# Altium schematic sheet dcdc_60v_12v.SchDoc
size A4; SheetNumber: 8; SheetTotal: 8; SPICEModelCacheOFSRASBJ: <root> / <DocumentId>OFSRASBJ</DocumentId> / <CacheFrame Number="0"> / <Model Name="tmk325b7226_m-pr" Kind="CKT"> / <Text>* TMK325B7226_M-PR     SPICE MODEL  ( General Type ) / *-------------------------------------------------------------------------------------------------------- / * Model Generated by TAIYO YUDEN Corporation (http://www.ty-top.com) / * Version 1.0 / * TAIYO YUDEN Control No. 170508_150330 / * Copyright(c) 2015 TAIYO YUDEN CO.,LTD. All Rights Reserved. / *-------------------------------------------------------------------------------------------------------- / * / * Products Name : Multilayer Ceramic Capacitors / * / * Characteristics : / *     Capacitance : 22 uF , Rated Voltage : 25V , TCC : X7R / *     Case Size : 3.2 x 2.5 / 0.126 x 0.098 [mm/inch] , Thickness : 2.5 / 0.098 [mm/inch] / *     (Conditions: Temperature = 25 degC , DC Bias Current/Voltage = 0A / 0V) / * / * Frequency Range : 40Hz - 3GHz / * / * External Node Assignments : / * / *  1  o---| |---o  2 / * / *-------------------------------------------------------------------------------------------------------- / .SubCkt TMK325B7226_M-PR 1 2 / **************************** / C0 1 110 20.232u / Cm 1 101 1.4192u / C1 101 102 0.46072u / Rc1 101 102 383.24 / C2 102 103 0.25707u / Rc2 102 103 27.255 / C3 103 110 0.063707u / Rc3 103 110 9.0927 / C2m 1 301 2.8514u / C21 301 302 4.5381u / Rc21 301 302 971.82 / C22 302 303 5.7922u / Rc22 302 303 294.55 / C23 303 304 5.617u / Rc23 303 304 301.8 / C24 304 305 2.3653u / Rc24 304 305 34.154 / C25 305 306 1.0031u / Rc25 305 306 28.966 / C26 306 307 0.1463u / Rc26 306 307 1.8028 / C27 307 308 0.26562u / Rc27 307 308 0.93359 / C28 308 309 0.29812u / Rc28 308 309 0.7461 / C29 309 110 3869.2p / Rc29 309 110 3.935 / Rp0 1 110 4.54545454545455Meg / L0 110 120 0.19079n / Lm 120 130 0.18902n / L1 120 121 0.21321n / RL1 121 130 0.13225 / L2 120 122 0.31017n / RL2 122 130 0.16258 / L3 120 123 1.2596n / RL3 123 130 144.01 / CR 120 124 3.8286u / LR 124 125 0.37731n / RR 125 130 10.878m / CL 130 140 3.0471p / LL 130 140 0.15642n / RL 130 140 11.971 / Rs 140 2 2.3557m / **************************** / .ends TMK325B7226_M-PR</Text> / </Model> / </CacheFrame> / </root>
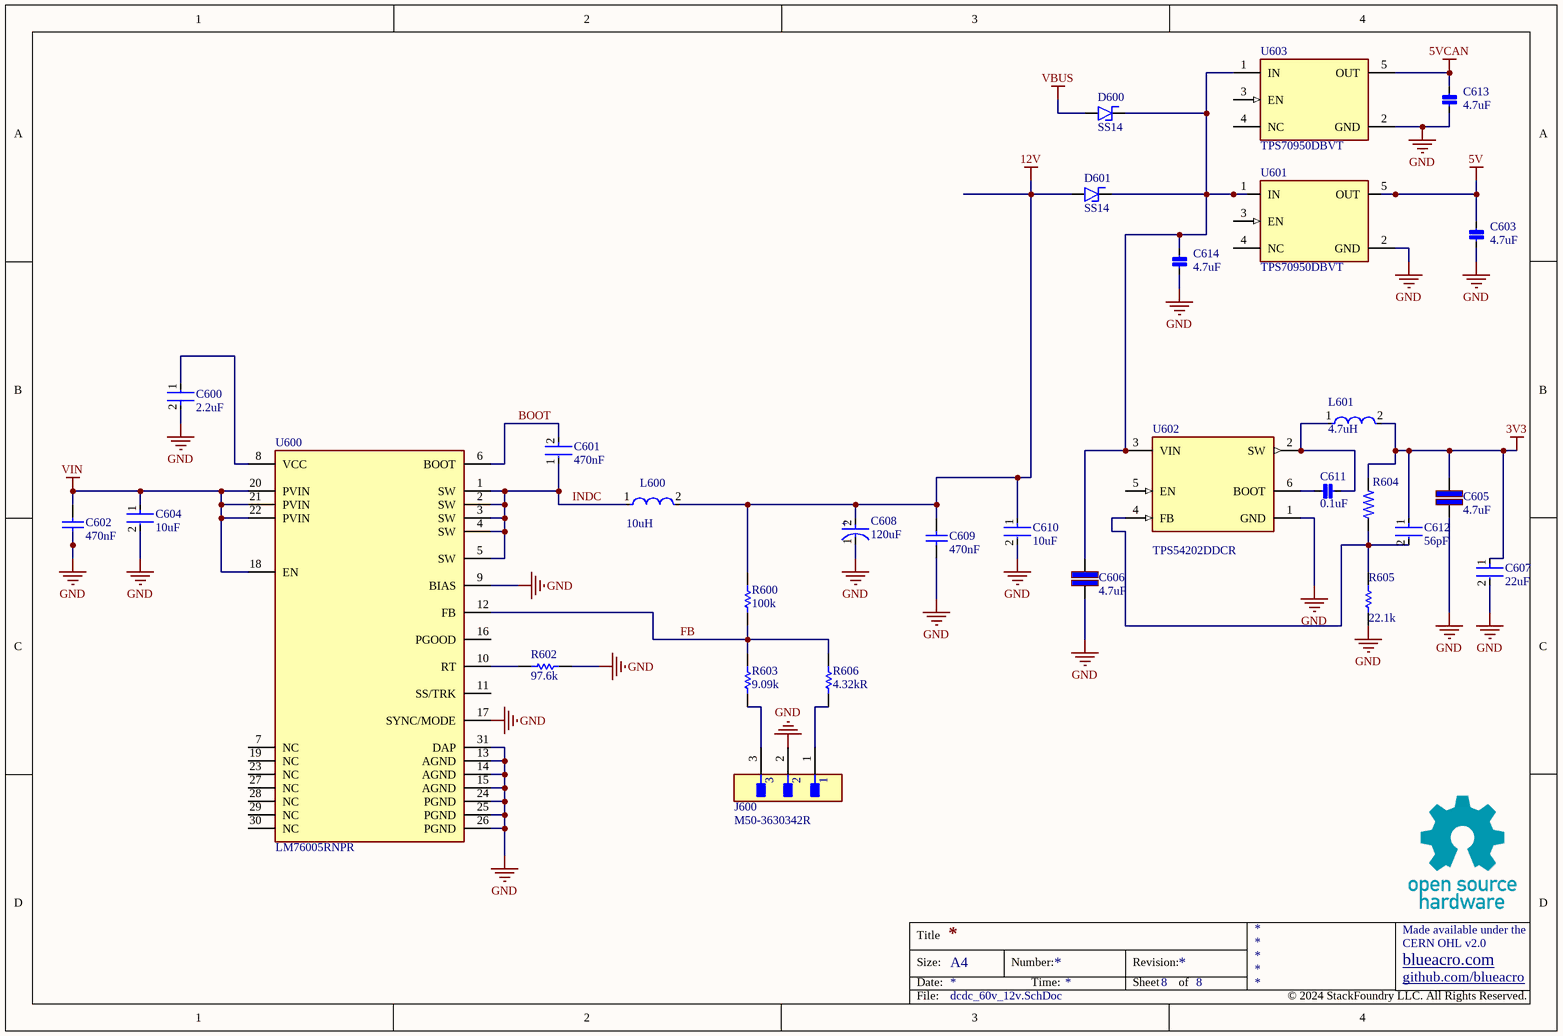
[diagram p0: dcdc_60v_12v.SchDoc]

## Parts
C600  value 2.2uF  [FP-C1608-080-0_1-IPC_A]  (hidden comment: CAP 2.2uF 0603 16V X6S)
C601  value 470nF  [FP-C1608-080-0_1-IPC_A]  (hidden comment: CAP 0.47uF 50V 0603)
C602  value 470nF  [CAPC1210(3225)230_M]  (hidden comment: CAP 0.47uF 1210 50V X7R)
C603  value 4.7uF  [FP-CL10-IPC_C]  (hidden comment: CAP 4.7uF 0603 6.3V X7R)
C604  value 10uF  [FP-GRM32E-0_2-0_3-MFG]  (hidden comment: CAP 10uF 1210 63V X7R)
C605  value 4.7uF  [CAPC3225X20N]  (hidden comment: CAP 4.7uF 50V X7R 1210)
C606  value 4.7uF  [CAPC3225X20N]  (hidden comment: CAP 4.7uF 50V X7R 1210)
C607  value 22uF  [FP-1210-L_3_2_0_3-W_2_5_0-MFG]  (hidden comment: CAP 22uF 25V 1210 X7R)
C608  value 120uF  [FP-OS-CON-SMT-F12-MFG]  (hidden comment: CAP 120uF 35V Poly 10mm)
C609  value 470nF  [CAPC1210(3225)230_M]  (hidden comment: CAP 0.47uF 1210 50V X7R)
C610  value 10uF  [FP-GRM32E-0_2-0_3-MFG]  (hidden comment: CAP 10uF 1210 63V X7R)
C611  value 0.1uF  [FP-CL10-IPC_B]  (hidden comment: CAP 0.1uF 50V X7R 0603)
C612  value 56pF  [FP-C0603C-CF-IPC_B]  (hidden comment: C0603C560J5GACTU)
C613  value 4.7uF  [FP-CL10-IPC_C]  (hidden comment: CAP 4.7uF 0603 6.3V X7R)
C614  value 4.7uF  [FP-CL10-IPC_C]  (hidden comment: CAP 4.7uF 0603 6.3V X7R)
D600  SS14  [SMA]
D601  SS14  [SMA]
J600  M50-3630342R  [FP-M50-3630342R-MFG]
L600  value 10uH  [FP-IHLP-5050FD-FP_2_945x4-MFG]  (hidden comment: IHLP5050FDER100M01)
L601  value 4.7uH  [FP-SRN4018-MFG]  (hidden comment: SRN4018-4R7M)
R600  value 100k  [RESC1608-IPC-LL]  (hidden comment: 100k 0603 1%)
R602  value 97.6k  [RESC1608-IPC-LL]  (hidden comment: 97.6k 0603 1%)
R603  value 9.09k  [RESC1608-IPC-LL]  (hidden comment: 9.09k 0603 1%)
R604  100k 0603 1%  [RESC1608-IPC-LL]  (value not drawn)
R605  value 22.1k  [RESC1608-IPC-LL]  (hidden comment: 22.1k 0603 0.1%)
R606  value 4.32kR  [RESC1608X55X30LL15T15]  (hidden comment: 4.32k 0603 1%)
U600  LM76005RNPR  [FP-RNP0030A-MFG]
U601  TPS70950DBVT  [FP-DBV0005A-IPC_B]
U602  TPS54202DDCR  [FP-DDC0006A-IPC_C]
U603  TPS70950DBVT  [FP-DBV0005A-IPC_B]

## Nets
3V3: C605.2 C607.1 C612.1 L601.2 R604.2
5V: C603.1 U601.5(OUT)
5VCAN: C613.1 U603.5(OUT)
12V: C608.2(A) C609.2 C610.1 D601.A L600.2 R600.2
GND: C600.2 C602.1 C603.2 C604.2 C605.1 C606.1 C607.2 C608.1(C) C609.1 C610.2 C613.2 C614.2 J600.2 R602.2 R605.1 U600.9(BIAS) U600.13(AGND) U600.14(AGND) U600.15(AGND) U600.17(SYNC/MODE) U600.24(PGND) U600.25(PGND) U600.26(PGND) U600.31(DAP) U601.2(GND) U602.1(GND) U603.2(GND)
VBUS: D600.A
VIN: C602.2 C604.1 U600.18(EN) U600.20(PVIN) U600.21(PVIN) U600.22(PVIN)
BOOT: C601.2 U600.6(BOOT)
FB: R600.1 R603.2 R606.2 U600.12(FB)
INDC: C601.1 L600.1 U600.1(SW) U600.2(SW) U600.3(SW) U600.4(SW) U600.5(SW)
NetC600_1: C600.1 U600.8(VCC)
NetC606_2: C606.2 C614.1 D600.K D601.K U601.1(IN) U602.3(VIN) U603.1(IN)
NetC611_1: C611.1 U602.6(BOOT)
NetC611_2: C611.2 L601.1 U602.2(SW)
NetC612_2: C612.2 R604.1 R605.2 U602.4(FB)
NetJ600_1: J600.1 R606.1
NetJ600_3: J600.3 R603.1
NetR602_1: R602.1 U600.10(RT)

Not connected (* = marked no-connect by the designer): U600 7(NC) 11(SS/TRK) 16(PGOOD) 19(NC) 23(NC) 27(NC) 28(NC) 29(NC) 30(NC); U601 3(EN) 4(NC); U602 5(EN); U603 3(EN) 4(NC)

## Notes on the sheet
- Title
- Size:
- Date:
- A4
- Number:
- Time:
- Revision:
- Sheet
- of
- github.com/blueacro
- blueacro.com
- CERN OHL v2.0
- Made available under the
- File:
- © 2024 StackFoundry LLC. All Rights Reserved.
- (in symbol CMP-001-00127-1) +

## Library data of the parts
C600 = CMP-001-00117-2: Cap Ceramic 2.2uF 16V X6S 10% Pad SMD 0603 105°C Low ESR T/R; Length: 1.6mm; Height: 0.8mm; Case/Package: 0603; Tolerance: 10%; Series: C; Dielectric Material: Ceramic; Dielectric: X6S; Construction: Flat; Case Code (Metric): 1608; Lead Free: Lead Free; Case Code (Imperial): 0603; Depth: 0.8mm; Thickness: 0.035inch; Voltage Rating: 16V
C601 = CMP-001-00116-2: Multilayer Ceramic Capacitor, 0.47 uF, 50 V, ± 10%, X7R, 0603 [1608 Metric]; Height: 0.8mm; Tolerance: 10%; Length: 1.6mm; Voltage Rating: 50V; Depth: 0.8mm; Case Code (Metric): 1608; Voltage: 50V; Lead Free: Lead Free; Series: C; Dielectric: X7R; Dielectric Material: Ceramic; Construction: Flat; Case Code (Imperial): 0603; Case/Package: 0603; Material: Ceramic
C602 C609 = CMP-001-00128-1: Multilayer Ceramic Capacitor, 0.47 uF, 50 V, ± 10%, X7R, 1210 [3225 Metric]; Termination: SMD/SMT; Voltage Rating: 50V; Dielectric: X7R; Case Code (Metric): 3225; Case/Package: 1210; Thickness: 0.041inch; Tolerance: 10%; Lead Free: Lead Free; Depth: 2.5mm; Case Code (Imperial): 1210; Length: 3.2mm; Voltage Rating (DC): 50V; Series: C; Height: 0.95mm; Construction: Flat; RoHS Compliant: Yes; Package Quantity: 1; Dielectric Material: Ceramic; Width: 0.098inch; Reach SVHC Compliant: No; Min Operating Temperature: -55°C; Packaging: Tape and Reel; Voltage: 50V; Mounting Technology: Surface Mount,PCB; Max Operating Temperature: 125°C
C603 C613 C614 = CMP-001-00101-4: Cap Ceramic 4.7uF 6.3V X7R 10% SMD 0603 125°C Paper T/R
C604 C610 = CMP-001-00119-1: Multilayer Ceramic Capacitors MLCC - SMD/SMT 1210 10uF 63volts *Derate Voltage/Temp; Tolerance: 10%; Voltage Rating: 63V; Case Code (Metric): 3225; Voltage: 63V; Thickness: 0.106inch; Case Code (Imperial): 1210; Dielectric Material: Ceramic; Depth: 2.5mm; Material: Ceramic; Series: GRM; Length: 3.2mm; Height: 2.5mm; Width: 2.5mm; Voltage Rating (DC): 63V; Termination: SMD/SMT; Dielectric: X7R; Case/Package: 1210
C605 C606 = CMP-001-00083-3: CAP CER 4.7UF 50V X7R 1210; Tolerance: 10%; Material: Ceramic; Voltage: 50V; Capacitance: 4.7uF; Width: 0.098inch; Height: 1.8mm; Depth: 2.5mm; Package Quantity: 1; Case/Package: 1210; Case Code (Imperial): 1210; Contact Plating: Tin; Thickness: 0.079inch; Radiation Hardening: No; Voltage Rating: 50V; Packaging: Tape and Reel; Lead Free: Lead Free; Dielectric: X7R; Min Operating Temperature: -55°C; Case Code (Metric): 3225; Max Operating Temperature: 125°C; Mount: Surface Mount; Length: 3.2mm
C607 = CMP-001-00125-1: 1210 22 uF 25 V ±20% Tolerance X7R Multilayer Ceramic Chip Capacitor; Tolerance: 20%; Series: M; Max Operating Temperature: 125°C; Min Operating Temperature: -55°C; Case Code (Metric): 3225; Mounting Technology: Surface Mount; Case/Package: 1210; RoHS Compliant: Yes; Voltage Rating: 25V; Packaging: Tape and Reel; Case Code (Imperial): 1210
C608 = CMP-001-00127-1: Cap Aluminum Polymer 120uF 35VDC 20%( 10 X 12.6mm) SMD 0.018 Ohm 4400mA 5000h 105C T/R; Leakage Current: 840uA; Ripple Current (AC): 4.4A; Dissipation Factor: 12%; ESR (Equivalent Series Resistance): 18mR; Life (Hours): 5000Hour; Max Operating Temperature: 105°C; Height: 12.6mm; Min Operating Temperature: -55°C; Diameter: 10mm; Length: 12.6mm; Voltage: 35V; Tolerance: 20%; Voltage Rating: 35V; Lead Free: Lead Free; Voltage Rating (DC): 35V; Case/Package: Radial; Ripple Current: 4.4A; Series: OS-CON™, SVPF; Package Quantity: 400; Termination: SMD/SMT; Pins: 12; Material: Polymer; Packaging: Tape and Reel; RoHS Compliant: Yes; Mounting Technology: Surface Mount,PCB; Reach SVHC Compliant: No
C611 = CMP-001-00084-7: Cap Ceramic 0.1uF 50V X7R 20% SMD 0603 125C Paper T/R; Voltage: 50V
C612 = CMP-001-00126-1: Multilayer Ceramic Capacitor, 56 pF, 50 V, ± 5%, C0G (NP0), 0603 [1608 Metric]; Temperature Coefficient: 30ppm/°C; Voltage Rating (DC): 50V; Radiation Hardening: No; Min Operating Temperature: -55°C; Pins: 2; Depth: 0.8mm; Termination: SMD/SMT; Dielectric: C0G; Thickness: 0.034inch; Package Quantity: 1; RoHS Compliant: Yes; Reach SVHC Compliant: No; Lead Free: Lead Free; Length: 1.6mm; Mounting Technology: Surface Mount,PCB; Packaging: Tape and Reel; Width: 0.031inch; Height: 0.8mm; Material: Ceramic; Series: C; Case Code (Metric): 1608; Tolerance: 5%; Max Operating Temperature: 125°C; Lead Pitch: 0.7mm; Voltage Rating: 50V; Case Code (Imperial): 0603; Construction: Flat; Case/Package: 0603
D600 D601 = CMP-080-0002-2: Source: diode.SCHLIB; Design Item ID: DIODE_SCHOTTKY
J600 = CMP-002-00105-2: 3 Pos. Male SIL Vertical SMT Conn. RoHS Compliant: Yes; Current Rating: 1A; Number of Positions: 3; Connector Type: Header; RoHS Compliant: Yes; Series: Archer M50; Fastening Type: Pull; Min Operating Temperature: -40°C; Termination: Solder; Contact Material: Brass; Mounting Technology: Surface Mount; Packaging: Cut Tape; Contact Finish - Mating: GOLD; Contact Shape: Square; Insulation Color: Black; Contact Type: Male Pin; Max Operating Temperature: 105°C; Flammability Rating: UL94 V-0; Insulation Material: Nylon; Number of Rows: 1
L600 = CMP-006-00033-1: Inductor Power Shielded Wirewound 10uH 20% 100KHz Powdered Iron 10A 17.2mOhm DCR 5050 T/R; Core Material: Metal,Composite,Ferrite; Max DC Current: 15.5A; DC Resistance (DCR): 17.2mR; Self Resonant Frequency: 5MHz; Case/Package: 5050; Width: 12.9mm; Mounting Technology: Surface Mount; Height: 6.5mm; Saturation Current: 15.5A; Tolerance: 20%; Length: 13.2mm; Depth: 12.9mm; Inductance Tolerance: 20%; Test Frequency: 100kHz; RMS Current (Irms): 10A; Shielding: Shielded; Pins: 2; ESR: 17.2mR; Max Operating Temperature: 125°C; Max Current Rating: 10A; Lead Free: Lead Free; Military Standard: Not; Reach SVHC Compliant: Unknown; Packaging: Tape and Reel; RoHS Compliant: Yes; Package Quantity: 250; Series: IHLP-5050FD-01; Termination: SMD/SMT; Radiation Hardening: No; Min Operating Temperature: -55°C
L601 = CMP-006-00036-2: Ind Power Semi-Shielded Wirewound 4.7uH 20% 100KHz Ferrite 1.9A 1515 T/R; Material: Steel; Self Resonant Frequency: 35MHz; DC Resistance (DCR): 84mR; Saturation Current: 2A; Q Factor: 9; Radiation Hardening: No; Reach SVHC Compliant: No; Sample Rate (Hz): 100kHz; Package Quantity: 3000; RoHS Compliant: Yes; Depth: 4.2mm; Max DC Current: 1.9A; Case/Package: Nonstandard; Min Operating Temperature: -25°C; Test Frequency: 100kHz; Max Operating Temperature: 120°C; Pins: 2; Shielding: Shielded; Packaging: Cut Tape; Height - Seated (Max): 0.071inch; Inductance Tolerance: 20%; RMS Current (Irms): 1.9A; Current Rating: 1.9A; Core Material: Ferrite; Width: 4mm; Height: 1.8mm; Tolerance: 20%; Length: 4mm; Series: SRN4018; Termination: SMD/SMT; Mounting Technology: Surface Mount; ESR: 84mR
R600 = CMP-009-00222-1: SMD Chip Resistor, 100 kOhm, ± 1%, 100 mW, 0603 [1608 Metric], Thick Film, General Purpose; Voltage Rating: 50V; Case Code (Metric): 1608; Height: 0.45mm; Tolerance: 1%; Width: 0.8mm; Resistance Tolerance: 1%; Case/Package: 0603; Case Code (Imperial): 0603
R602 = CMP-009-00223-1: Res Thick Film 0603 97.6K Ohm 1% 1/10W ±100ppm/°C Molded SMD Paper T/R; Voltage Rating: 75V; Power Rating: 100mW; Contact Plating: Tin,Matte; Series: RC; Tolerance: 1%; Case/Package: 0603; Height: 0.022inch; Width: 0.031inch; Weight: 7.1E-05oz; Case Code (Imperial): 0603; Case Code (Metric): 1608
R603 = CMP-009-00221-1: SMD Chip Resistor, 9.09 kOhm, ± 1%, 100 mW, 0603 [1608 Metric], Thick Film, General Purpose; Features: Moisture Resistant; Case Code (Imperial): 0603; Case/Package: 0603; Case Code (Metric): 1608
R604 = CMP-009-00203-1: Res Thick Film 1.6 x 0.8 mm 100K Ohm 1% 0.1W(1/10W) 100ppm/ C Molded SMD Paper T/R
R605 = CMP-009-00207-3: RES SMD 22.1KOHM 0.1% 1/10W 0603
R606 = CMP-009-00239-1: SMD Chip Resistor, 4.32 kOhm, ± 1%, 100 mW, 0603 [1608 Metric], Thick Film, Precision; Voltage Rating (DC): 50V; Voltage Rating: 75V; Temperature Coefficient: 100ppm/°C; Power Rating: 100mW; Reach SVHC Compliant: No; Case/Package: 0603; Radiation Hardening: No; Height: 0.45mm; Series: ERJ; Depth: 0.8mm; Contact Plating: Tin; Case Code (Imperial): 0603; Construction: Rectangular; Min Operating Temperature: -55°C; Technology: THICK FILM; Tolerance: 1%; Max Operating Temperature: 155°C; Mounting Technology: Surface Mount; Length: 1.6mm; Lead Free: Lead Free; RoHS Compliant: Yes; Case Code (Metric): 1608; Package Quantity: 1; Max Power Dissipation: 100mW; Termination: SMD/SMT; Packaging: Tape and Reel; Features: Automotive AEC-Q200; Resistance Tolerance: 1%; Resistor Type: Thick Film; Military Standard: Not; Number of Terminations: 2; Width: 0.8mm
U600 = CMP-019-00072-2: 3.5-V to 60-V, 5-A synchronous step-down voltage converter 30-WQFN -40 to 125; Max Supply Voltage: 60V; Max Output Voltage: 57V; Min Input Voltage: 3.5V; Max Operating Temperature: 125°C
U601 U603 = CMP-019-00083-1: IC REG LINEAR 5V 150MA SOT23-5 / 150-mA, 30-V, UltraLow IQ, Low-Dropout Regulators with Enable; Accuracy: 2%; Number of Outputs: 1; Quiescent Current: 1uA; Output Type: Fixed; Max Supply Voltage: 30V; Polarity: Positive; Min Input Voltage: 2.7V; Power Supply Rejection Ratio (PSRR): 80dB; Min Current Limit: 200mA; Dropout Voltage: 690mV; Width: 1.75mm; Length: 3.05mm; Pins: 5; Output Current: 150mA; Output Voltage: 5V; Series: -; Case/Package: SOT-23-5; Height: 1.3mm; Number of Regulators: 1; Mounting Technology: Surface Mount; Min Operating Temperature: -40°C; Max Operating Temperature: 125°C; Packaging: Tape and Reel; RoHS Compliant: Yes; Reach SVHC Compliant: No; Lead Free: Lead Free; Nominal Output Voltage: 5V; Radiation Hardening: No; Max Output current: 150mA; Package Quantity: 250
U602 = CMP-019-00081-1: 4.5V to 28V Input, 2A Output, EMI Friendly Synchronous Step-Down Converter 6-SOT-23-THIN -40 to 125; Min Output Voltage: 596mV; Synchronous Rectifier: Yes; Number of Outputs: 1; Output Type: Adjustable; Switching Frequency: 500kHz; Output Configuration: Positive; Max Duty Cycle: 100%; Quiescent Current: 40uA; Nominal Supply Current: 45uA; Mounting Technology: Surface Mount; Series: Eco-Mode™; RoHS Compliant: Yes; Packaging: Tape and Reel; Case/Package: SOT-23-6; Min Input Voltage: 4.5V; Min Operating Temperature: -40°C; Max Supply Voltage: 28V; Max Operating Temperature: 125°C; Max Output Voltage: 28V; Output Current: 2A; Width: 1.6mm; Thickness: 870um; Height: 1.1mm; Min Supply Voltage: 4.5V; Length: 2.9mm; Number of Channels: 1; Lead Free: Lead Free; Pins: 6